# Altium project STM32F334R8T6Board_PRJ.PrjPcb
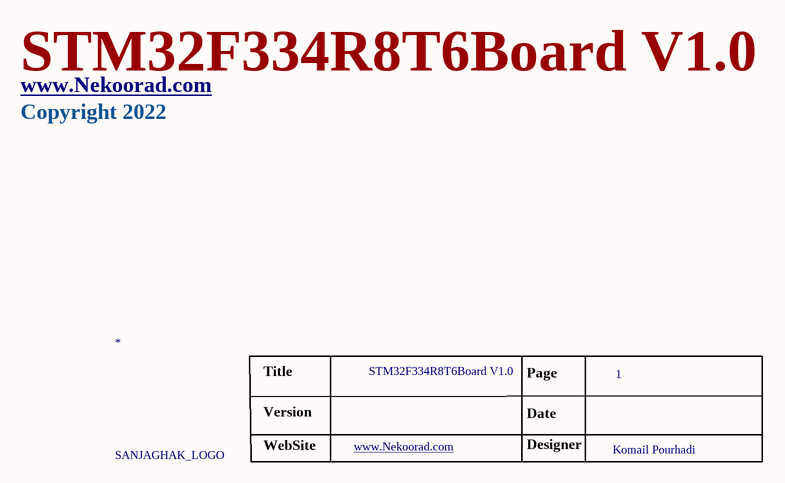
[diagram p0: [00]_NekooradGroup.SchDoc]
designer: Dotex:.; version: V1.0
4 sheets, 192 parts. Net scope: flat (ports and power ports of the same name join across sheets).
Board file: STM32F334R8T6Board_PCB.PcbDoc
Sheets:
  [00]_NekooradGroup.SchDoc
  [1]STM32F334R8T6Board_MCU.SchDoc
  [2]STM32F334R8T6Board_Interfaces.SchDoc
  [3]STM32F334R8T6Board_FilterAndOutputs.SchDoc

## Sheet [00]_NekooradGroup.SchDoc
size A

### Parts
*  SANJAGHAK_LOGO  [SANJAGHAK_LOGO]

### Notes on the sheet
- STM32F334R8T6Board V1.0
- www.Nekoorad.com <http://www.Nekoorad.com>
- Copyright 2022
- Title
- Page
- 1
- Version
- WebSite
- Date
- Designer
- Komail Pourhadi

## Sheet [1]STM32F334R8T6Board_MCU.SchDoc
size B
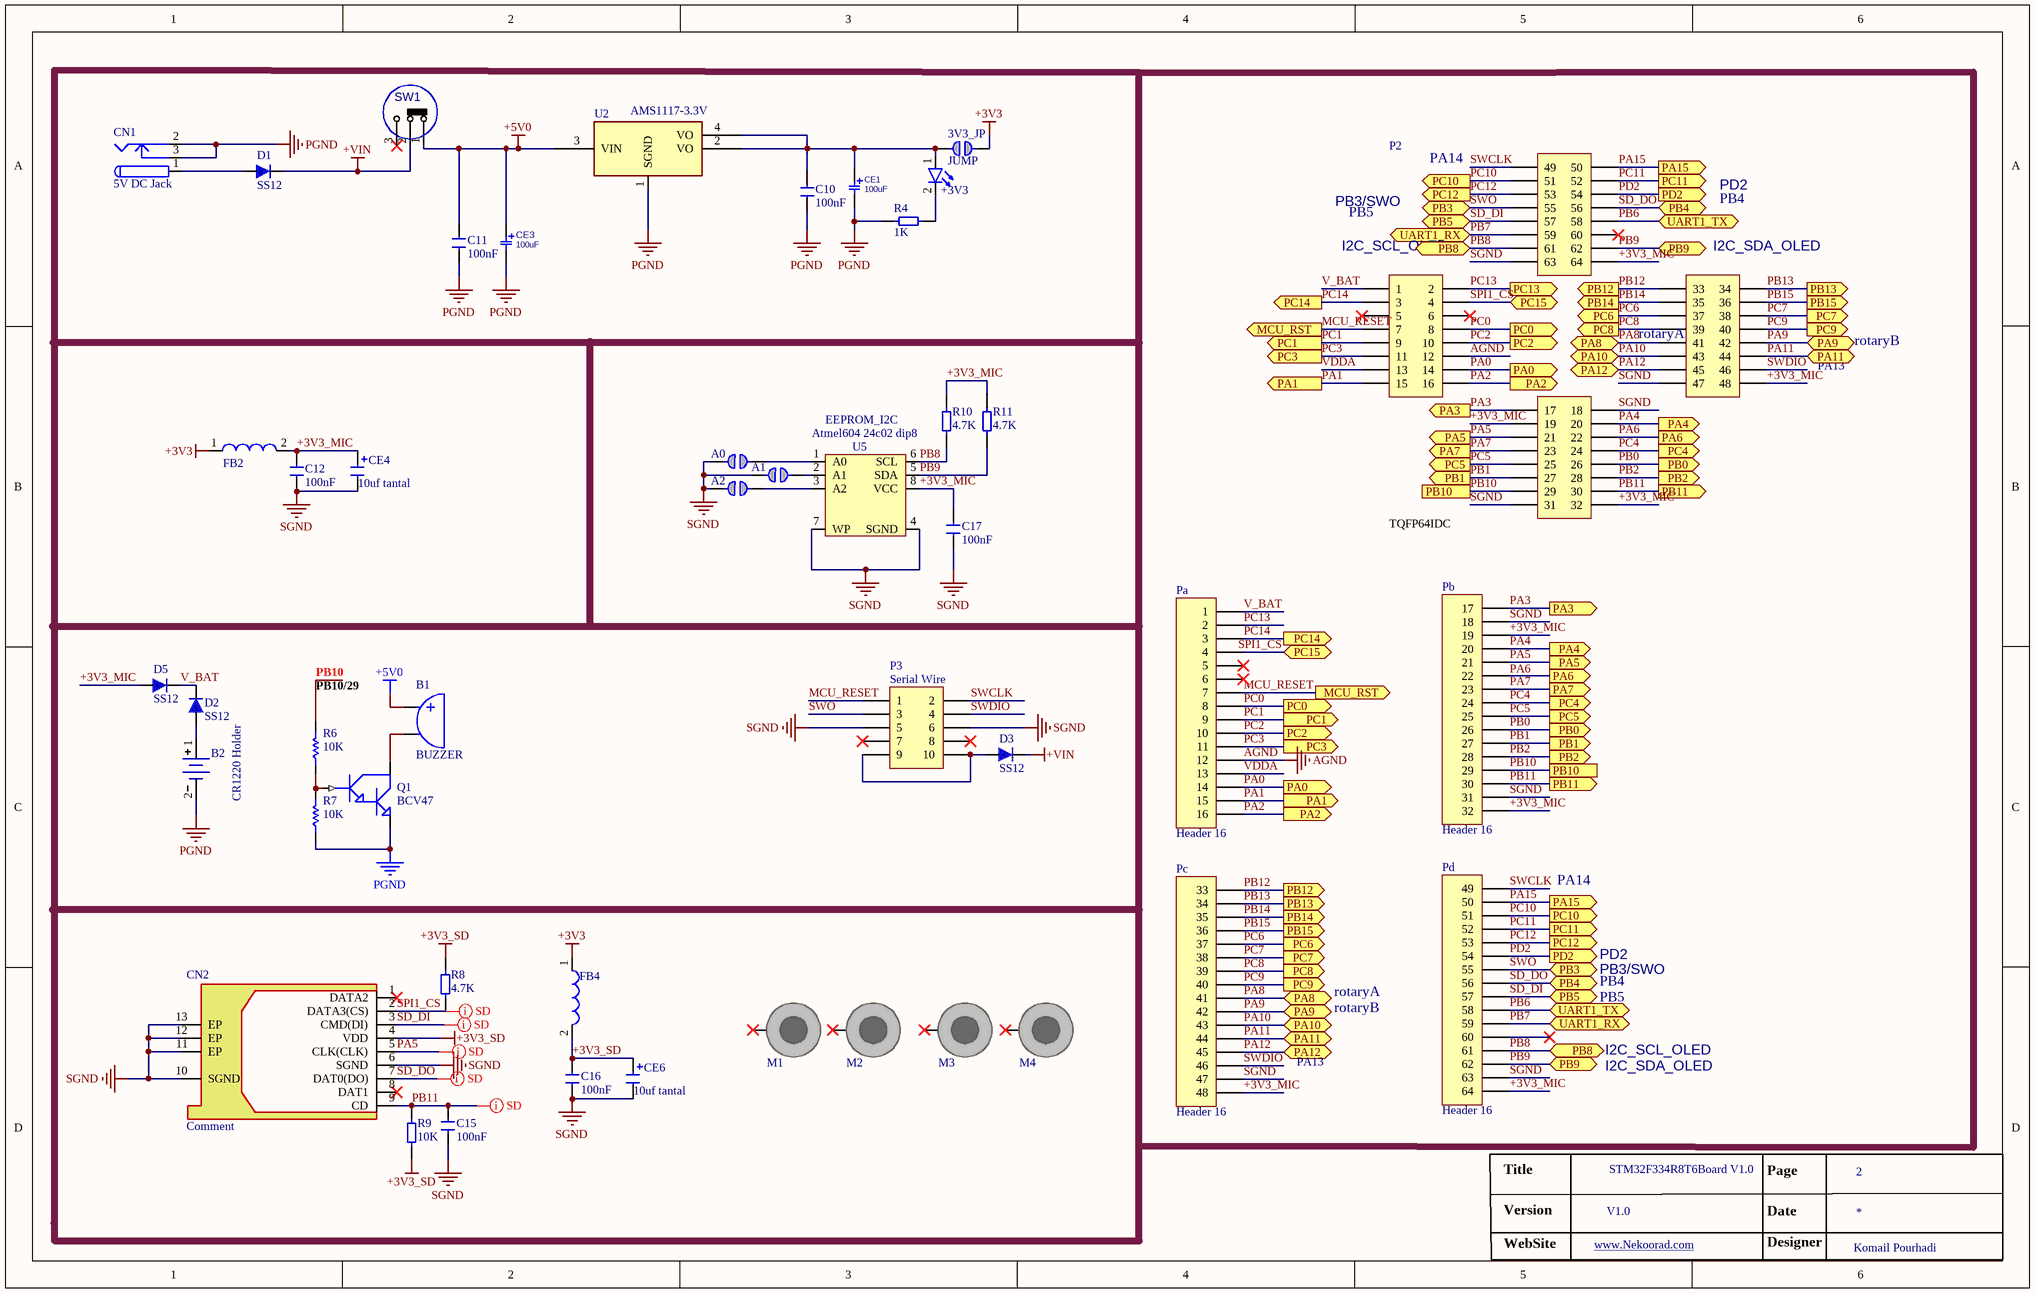
[diagram p1: [1]STM32F334R8T6Board_MCU.SchDoc]

### Parts
3V3_JP  JUMP  [RES_1206]
+3V3  HB  [LED SMD 1206]  (value not drawn)
A0  Comment  [HDR1X2]  (value not drawn)
A1  Comment  [HDR1X2]  (value not drawn)
A2  Comment  [HDR1X2]  (value not drawn)
B1  BUZZER  [BUZZ]
B2  CR1220 Holder  [Battery3]
C10  Comment  [SMD_CAP_1206]  (value not drawn)
C11  Comment  [SMD_CAP_1206]  (value not drawn)
C12  Comment  [SMD_CAP_1206]  (value not drawn)
C15  Comment  [SMD_CAP_1206]  (value not drawn)
C16  Comment  [SMD_CAP_1206]  (value not drawn)
C17  Comment  [SMD_CAP_1206]  (value not drawn)
CE1  value 100uF  [CAP-E-4]  (hidden comment: Comment)
CE3  value 100uF  [CAP-E-4]  (hidden comment: Comment)
CE4  10uf tantal  [cap-e-2]
CE6  10uf tantal  [cap-e-2]
CN1  5V DC Jack  [Power Jack]
CN2  Comment  [Micro sd csrd]
D1  SS12  [Diode SMA-M]
D2  SS12  [Diode SMA-M]
D3  SS12  [Diode SMA-M]
D5  SS12  [Diode SMA-M]
FB2  Comment  [r4p]  (value not drawn)
FB4  Comment  [r4p]  (value not drawn)
M1  Comment  [Stud-hole]  (value not drawn)  (no BOM)
M2  Comment  [Stud-hole]  (value not drawn)  (no BOM)
M3  Comment  [Stud-hole]  (value not drawn)  (no BOM)
M4  Comment  [Stud-hole]  (value not drawn)  (no BOM)
P2  TQFP64IDC  [tqfp64idc]
P3  Serial Wire  [IDC10-BOX]
Pa  Header 16  [HDR1X16]
Pb  Header 16  [HDR1X16]
Pc  Header 16  [HDR1X16]
Pd  Header 16  [HDR1X16]
Q1  BCV47  [SOT23_BEC_M]
R4  Comment  [RES_1206]  (value not drawn)
R6  10K  [RES_1206]
R7  10K  [RES_1206]
R8  Comment  [RES_1206]  (value not drawn)
R9  Comment  [RES_1206]  (value not drawn)
R10  Comment  [RES_1206]  (value not drawn)
R11  Comment  [RES_1206]  (value not drawn)
SW1  SlideSwitch  [HDR1X3]  (value not drawn)
U2  value AMS1117-3.3V  [MP04A_M]  (hidden comment: Comment)
U5  EEPROM_I2C  [dip8]

### Ports
MCU_RST (out), PA0 (out), PA1 (out), PA2 (out), PA3 (out), PA4 (out), PA5 (out), PA6 (out), PA7 (out), PA8 (bidir), PA9 (bidir), PA10 (bidir), PA11 (bidir), PA12 (bidir), PA15 (out), PB0 (out), PB1 (out), PB2 (out), PB3 (bidir), PB4 (bidir), PB5 (bidir), PB8 (bidir), PB9 (bidir), PB10, PB11 (out), PB12 (out), PB13 (out), PB14 (out), PB15 (out), PC0 (out), PC1 (out), PC2 (out), PC3 (out), PC4 (out), PC5 (out), PC6 (out), PC7 (out), PC8 (out), PC9 (out), PC10 (out), PC11 (out), PC12 (out), PC13 (out), PC14 (out), PC15 (bidir), PD2 (out), UART1_RX (bidir), UART1_TX (bidir)

### Nets
+3V3: 3V3_JP.2 FB2.1 FB4.1
+3V3_SD: C16.2 CE6.1 CN2.4(VDD) FB4.2 R8.1 R9.2
+5V0: B1.1 C11.2 CE3.1 SW1.1(P1) U2.3(VIN)
+VIN: D1.2(K) D3.2(K) SW1.2(P3)
AGND: P2.12 Pa.12
PB6: P2.58 Pd.58 ; port UART1_TX
PB7: P2.59 Pd.59 ; port UART1_RX
PGND: B2.2(-) C10.1 C11.1 CE1.2 CE3.2 CN1.2 CN1.3 Q1.2(E) R4.2 R7.1 U2.1(SGND)
SGND: A0.1 A1.1 A2.1 C12.1 C15.2 C16.1 C17.1 CE4.2 CE6.2 CN2.6(SGND) CN2.10(SGND) CN2.11(EP) CN2.12(EP) CN2.13(EP) P2.18 P2.31 P2.47 P2.63 P3.5 P3.6 Pb.18 Pb.31 Pc.47 Pd.63 U5.4(SGND) U5.7(WP)
+3V3_MIC: C12.2 C17.2 CE4.1 D5.1(A) FB2.2 P2.19 P2.32 P2.48 P2.64 Pb.19 Pb.32 Pc.48 Pd.64 R10.1 R11.1 U5.8(VCC)
MCU_RESET: P2.7 P3.1 Pa.7 ; port MCU_RST
PA0: P2.14 Pa.14 ; port PA0
PA1: P2.15 Pa.15 ; port PA1
PA2: P2.16 Pa.16 ; port PA2
PA3: P2.17 Pb.17 ; port PA3
PA4: P2.20 Pb.20 ; port PA4
PA5: CN2.5(CLK(CLK)) P2.21 Pb.21 ; port PA5
PA6: P2.22 Pb.22 ; port PA6
PA7: P2.23 Pb.23 ; port PA7
PA8: P2.41 Pc.41 ; port PA8  [project net KEY1A]
PA9: P2.42 Pc.42 ; port PA9  [project net KEY2B]
PA10: P2.43 Pc.43 ; port PA10  [project net KEY3]
PA11: P2.44 Pc.44 ; port PA11  [project net KEY4]
PA12: P2.45 Pc.45 ; port PA12  [project net KEY5]
PA15: P2.50 Pd.50 ; port PA15
PB0: P2.26 Pb.26 ; port PB0
PB1: P2.27 Pb.27 ; port PB1
PB2: P2.28 Pb.28 ; port PB2
PB8: P2.61 Pd.61 R10.2 U5.6(SCL) ; port PB8  [project net I2C_SCL_OLED]
PB9: P2.62 Pd.62 R11.2 U5.5(SDA) ; port PB9  [project net EN]
PB10: P2.29 Pb.29 R6.2 ; port PB10
PB11: C15.1 CN2.9(CD) P2.30 Pb.30 R9.1 ; port PB11
PB12: P2.33 Pc.33 ; port PB12
PB13: P2.34 Pc.34 ; port PB13
PB14: P2.35 Pc.35 ; port PB14
PB15: P2.36 Pc.36 ; port PB15
PC0: P2.8 Pa.8 ; port PC0
PC1: P2.9 Pa.9 ; port PC1
PC2: P2.10 Pa.10 ; port PC2
PC3: P2.11 Pa.11 ; port PC3
PC4: P2.24 Pb.24 ; port PC4
PC5: P2.25 Pb.25 ; port PC5
PC6: P2.37 Pc.37 ; port PC6
PC7: P2.38 Pc.38 ; port PC7
PC8: P2.39 Pc.39 ; port PC8
PC9: P2.40 Pc.40 ; port PC9
PC10: P2.51 Pd.51 ; port PC10
PC11: P2.52 Pd.52 ; port PC11
PC12: P2.53 Pd.53 ; port PC12
PC13: P2.2 Pa.2 ; port PC13  [project net BKL]
PC14: P2.3 Pa.3 ; port PC14  [project net KEY6]
PD2: P2.54 Pd.54 ; port PD2
SD_DI: CN2.3(CMD(DI)) P2.57 Pd.57 ; port PB5
SD_DO: CN2.7(DAT0(DO)) P2.56 Pd.56 ; port PB4
SPI1_CS: CN2.2(DATA3(CS)) P2.4 Pa.4 R8.2 ; port PC15
SWCLK: P2.49 P3.2 Pd.49
SWDIO: P2.46 P3.4 Pc.46
SWO: P2.55 P3.3 Pd.55 ; port PB3
V_BAT: D2.2(K) D5.2(K) P2.1 Pa.1
VDDA: P2.13 Pa.13
Net3V3_JP_1: 3V3_JP.1 +3V3.1(A) C10.2 CE1.1 U2.2(VO) U2.4(VO)
Net+3V3_2: +3V3.2(K) R4.1
NetA0_2: A0.2 U5.1(A0)
NetA1_2: A1.2 U5.2(A1)
NetA2_2: A2.2 U5.3(A2)
NetB1_2: B1.2 Q1.3(C)
NetB2_1: B2.1(+) D2.1(A)
NetCN1_1: CN1.1 D1.1(A)
NetD3_1: D3.1(A) P3.9 P3.10
NetQ1_1: Q1.1(B) R6.1 R7.2

Not connected (* = marked no-connect by the designer): CN2 1(DATA2)* 8(DAT1)*; M1 1*; M2 1*; M3 1*; M4 1*; P2 5* 6* 60*; P3 7* 8*; Pa 5* 6*; Pd 60*; SW1 3(P4)*

### Layout directives
net class SD_card: PA5, PB11, SD_DI, SD_DO, SPI1_CS

### Notes on the sheet
- (near P2) PA14
- (near P2) PB3/SWO
- (near P2) PB5
- (near P2) PD2
- (near P2) PB4
- (near P2) I2C_SCL_OLED
- (near P2) I2C_SDA_OLED
- (near P2) rotaryA
- PA13
- rotaryB
- Atmel604 24c02 dip8
- PB10/29
- PA14
- PB3/SWO
- PD2
- rotaryA
- PB5
- PB4
- I2C_SCL_OLED
- I2C_SDA_OLED
- Title
- STM32F334R8T6Board V1.0
- Page
- 2
- Version
- WebSite
- www.Nekoorad.com <http://www.Nekoorad.com>
- Date
- Designer
- Komail Pourhadi
- Labels drawn without touching a wire or pin: PA6, SPI1_CS
- (in symbol Capacitor SMD) 100nF
- (in symbol Resistor SMD) 1K; 4.7K; 10K

### Library data of the parts
3V3_JP A0-A2 = jumper SMD
+3V3 = LED: Designer: Saeid Jorablo; Organazation: ControTec; Adding Date: 1387/12/22; Color: HB; Size: SMD 1206
B2 = Battry Backup
C10-C12 C15-C17 = Capacitor SMD
CE1 CE3 = CAP_THD_EL_10u25V: CAP, THD, ELEC, 10uF, 25V; MANF_P#: MANF_PART#; PARAM: 25V; MANF: MANF; PARAM2: PARAM2
CE4 CE6 = Capacitor Tantalium
CN1 = Power Jack
CN2 = Micro SD Card
D1-D3 D5 = 1N4001
FB2 FB4 = Ferrit Bead
M1-M4 = SCMH_M1P6: SCREW mouting, M1.6, 1.6mm diameter and 3.2mm PanHead; VALUE: DNP/MH; ASSEMBLY: DNP
P3 = Header 5X2: Header, 5-Pin, Dual row; LatestRevisionDate: 17-Jul-2002; LatestRevisionNote: Re-released for DXP Platform.; Publisher: Altium Limited
Pa Pb Pc Pd = Header 16: Header, 16-Pin; LatestRevisionDate: 17-Jul-2002; LatestRevisionNote: Re-released for DXP Platform.; Publisher: Altium Limited
Q1 = NPN DAR
R4 R8-R11 = Resistor SMD
R6 R7 = Resistor: Tolerance: 5%; Power: 1/8 W; Value: 10K
SW1 = SWSLIDT_SPDT_S_8X4: SWITCH, SLIDE, SPDT, 8.6X4.3mm, THD; MANF_PART#: OS102011MS2QN1; MANF: C&K; DESC: DESCRIPTION; VALUE: SlideSwitch; ASSEMBLY: ASSEMBLY; PARAM: PARAM; PRICE: 0.4$
U2 = VREG_1117_SOT223: REG, Linear, LDO1V, 0.8A, SOT-223; MANF_P#: LD1117, LM1117, AMS1117, TLV1117, REG1117, NCP1117, LT1117, SPX1117; MANF: TI, ON, ST; PARAM2: 1.2/1.5/1.8/2.5/2.85/3.3/5V; PARAM: LDO1V, 0.8A
U5 = AT24C128

## Sheet [2]STM32F334R8T6Board_Interfaces.SchDoc
size B
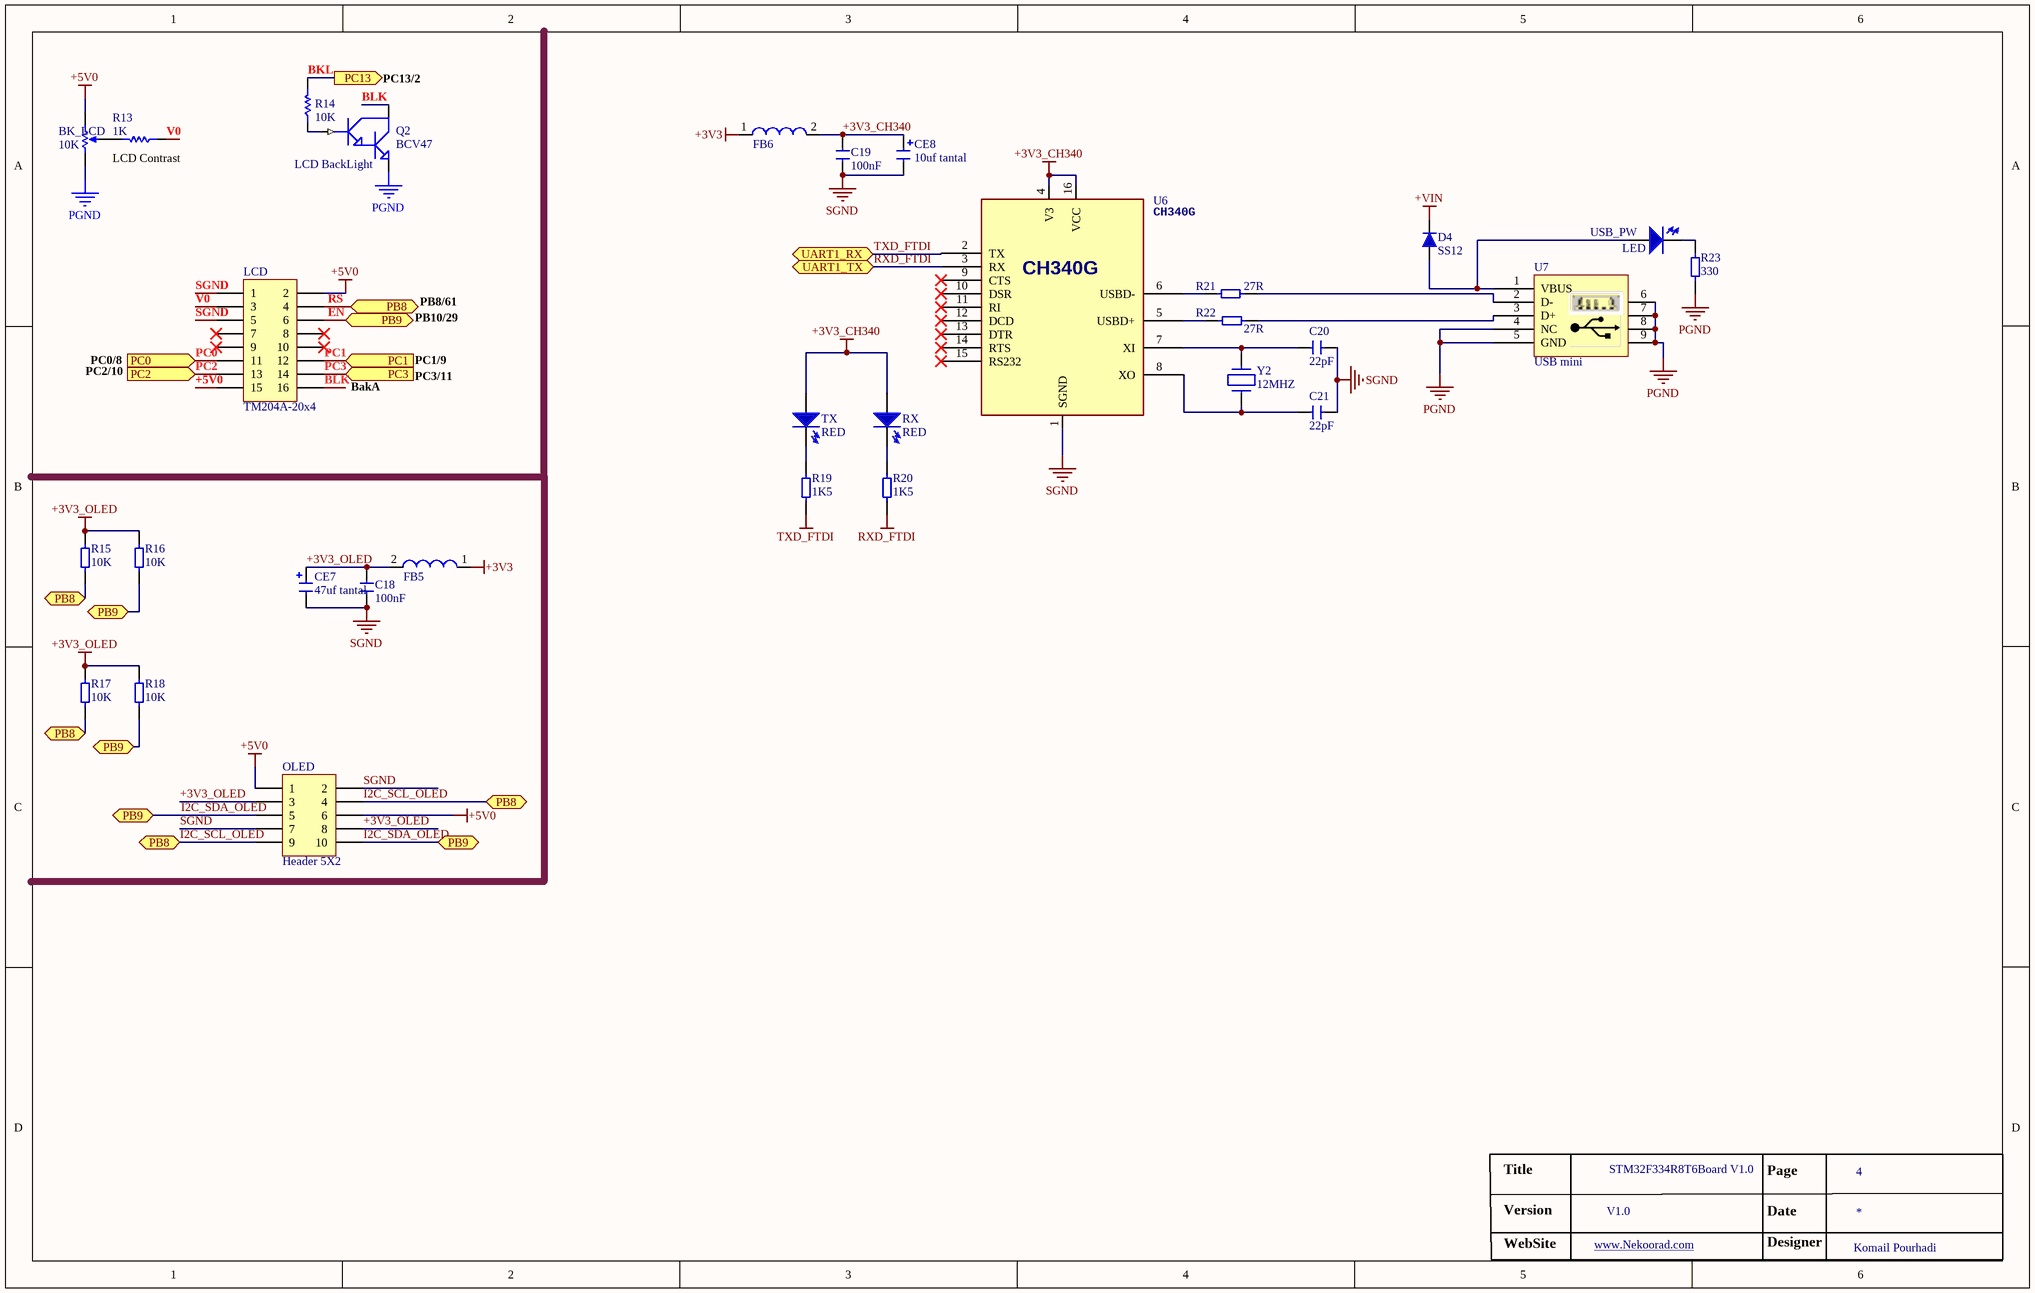
[diagram p2: [2]STM32F334R8T6Board_Interfaces.SchDoc]

### Parts
BK_LCD  value 10K  [JFP]  (hidden comment: RPot)
C18  Comment  [SMD_CAP_1206]  (value not drawn)
C19  Comment  [SMD_CAP_1206]  (value not drawn)
C20  Comment  [SMD_CAP_1206]  (value not drawn)
C21  Comment  [SMD_CAP_1206]  (value not drawn)
CE7  47uf tantal  [CAP-E-3]
CE8  10uf tantal  [cap-e-2]
D4  SS12  [Diode SMA-M]
FB5  Comment  [r4p]  (value not drawn)
FB6  Comment  [r4p]  (value not drawn)
LCD  TM204A-20x4  [IDC16_BOX]
OLED  Header 5X2  [IDC10-BOX]
Q2  BCV47  [SOT23_BEC_M]
R13  1K  [RES_1206]
R14  10K  [RES_1206]
R15  RESISTOR  [RES_1206]  (value not drawn)
R16  RESISTOR  [RES_1206]  (value not drawn)
R17  RESISTOR  [RES_1206]  (value not drawn)
R18  RESISTOR  [RES_1206]  (value not drawn)
R19  RESISTOR  [RES_1206]  (value not drawn)
R20  RESISTOR  [RES_1206]  (value not drawn)
R21  Comment  [RES_1206]  (value not drawn)
R22  Comment  [RES_1206]  (value not drawn)
R23  Comment  [RES_1206]  (value not drawn)
RX  RED  [LED SMD 1206]
TX  RED  [LED SMD 1206]
U6  CH340G  [Header smd 2*8]
U7  USB mini  [SMD_Mini USB Connector]
USB_PW  LED  [LED SMD 1206]
Y2  12MHZ  [Crystal SMD]

### Ports
PB8 (bidir), PB9 (bidir), PC0 (in), PC1 (in), PC2 (in), PC3 (in), PC13 (out), UART1_RX (bidir), UART1_TX (bidir)

### Nets
+3V3: FB5.1 FB6.1
+3V3_CH340: C19.2 CE8.1 FB6.2 RX.1(A) TX.1(A) U6.4(V3) U6.16(VCC)
+3V3_OLED: C18.2 CE7.1 FB5.2 OLED.3 OLED.8 R15.1 R16.1 R17.1 R18.1
+5V0: BK_LCD.3(BOT) LCD.2 LCD.15 OLED.1 OLED.6
+VIN: D4.2(K)
PGND: BK_LCD.1(TOP) Q2.2(E) R23.2 U7.4(NC) U7.5(GND) U7.6 U7.7 U7.8 U7.9
RXD_FTDI: R20.1 U6.3(RX) ; port UART1_TX  [project net PB6]
SGND: C18.1 C19.1 C20.1 C21.2 CE7.2 CE8.2 LCD.1 LCD.5 OLED.2 OLED.7 U6.1(SGND)
TXD_FTDI: R19.1 U6.2(TX) ; port UART1_RX  [project net PB7]
BKL: R14.2 ; port PC13
BLK: LCD.16 Q2.3(C)
EN: LCD.6 OLED.5 OLED.10 R16.2 R18.2 ; port PB9  [also labelled I2C_SDA_OLED]
I2C_SCL_OLED: LCD.4 OLED.4 OLED.9 R15.2 R17.2 ; port PB8  [also labelled RS]
PC0: LCD.11 ; port PC0
PC1: LCD.12 ; port PC1
PC2: LCD.13 ; port PC2
PC3: LCD.14 ; port PC3
V0: LCD.3 R13.1
NetBK_LCD_2: BK_LCD.2(TAP) R13.2
NetC20_2: C20.2 U6.7(XI) Y2.2
NetC21_1: C21.1 U6.8(XO) Y2.1
NetD4_1: D4.1(A) U7.1(VBUS) USB_PW.1(A)
NetQ2_1: Q2.1(B) R14.1
NetR19_2: R19.2 TX.2(K)
NetR20_2: R20.2 RX.2(K)
NetR21_1: R21.1 U6.6(USBD-)
NetR21_2: R21.2 U7.2(D-)
NetR22_1: R22.1 U6.5(USBD+)
NetR22_2: R22.2 U7.3(D+)
NetR23_1: R23.1 USB_PW.2(K)

Not connected (* = marked no-connect by the designer): LCD 7* 8* 9* 10*; U6 9(CTS)* 10(DSR)* 11(RI)* 12(DCD)* 13(DTR)* 14(RTS)* 15(RS232)*

### Notes on the sheet
- (near Q2) PC13/2
- LCD Contrast
- (near Q2) LCD BackLight
- PC0/8
- PC1/9
- PB10/29
- PB8/61
- PC2/10
- (near LCD) BakA
- PC3/11
- Title
- STM32F334R8T6Board V1.0
- Page
- 4
- Version
- WebSite
- www.Nekoorad.com <http://www.Nekoorad.com>
- Date
- Designer
- Komail Pourhadi
- (in symbol Capacitor SMD) 22pF; 100nF
- (in symbol Resistor SMD) 1K5; 27R; 10K; 330

### Library data of the parts
BK_LCD = RPot: Potentiometer; Sim Note: Enter the Resistance value and the set point into parameter fields.; Set Position: 0.5; Published: 8-Jun-2000; LatestRevisionDate: 17-Jul-2002; LatestRevisionNote: Re-released for DXP Platform.; PackageReference: VR5; Publisher: Altium Limited; PackageDescription: Variable Resistor, Thru-Hole; 3 Leads
C18-C21 = Capacitor SMD
CE7 CE8 = Capacitor Tantalium
D4 = 1N4001
FB5 FB6 = Ferrit Bead
LCD = Header 8X2: Header, 8-Pin, Dual row; LatestRevisionDate: 17-Jul-2002; LatestRevisionNote: Re-released for DXP Platform.; Publisher: Altium Limited
OLED = Header 5X2: Header, 5-Pin, Dual row; LatestRevisionDate: 17-Jul-2002; LatestRevisionNote: Re-released for DXP Platform.; Publisher: Altium Limited
Q2 = NPN DAR
R13 R14 = Resistor: Tolerance: 5%; Power: 1/8 W
  R13: Value: 1K
  R14: Value: 10K
R15-R23 = Resistor SMD
RX TX USB_PW = LED SMD
U6 = CH340G_SOP16: USB-UART; MANF_P#: CH340G; VALUE: CH340G
U7 = USB mini: mini USB Connector
Y2 = Xtal

## Sheet [3]STM32F334R8T6Board_FilterAndOutputs.SchDoc
size B
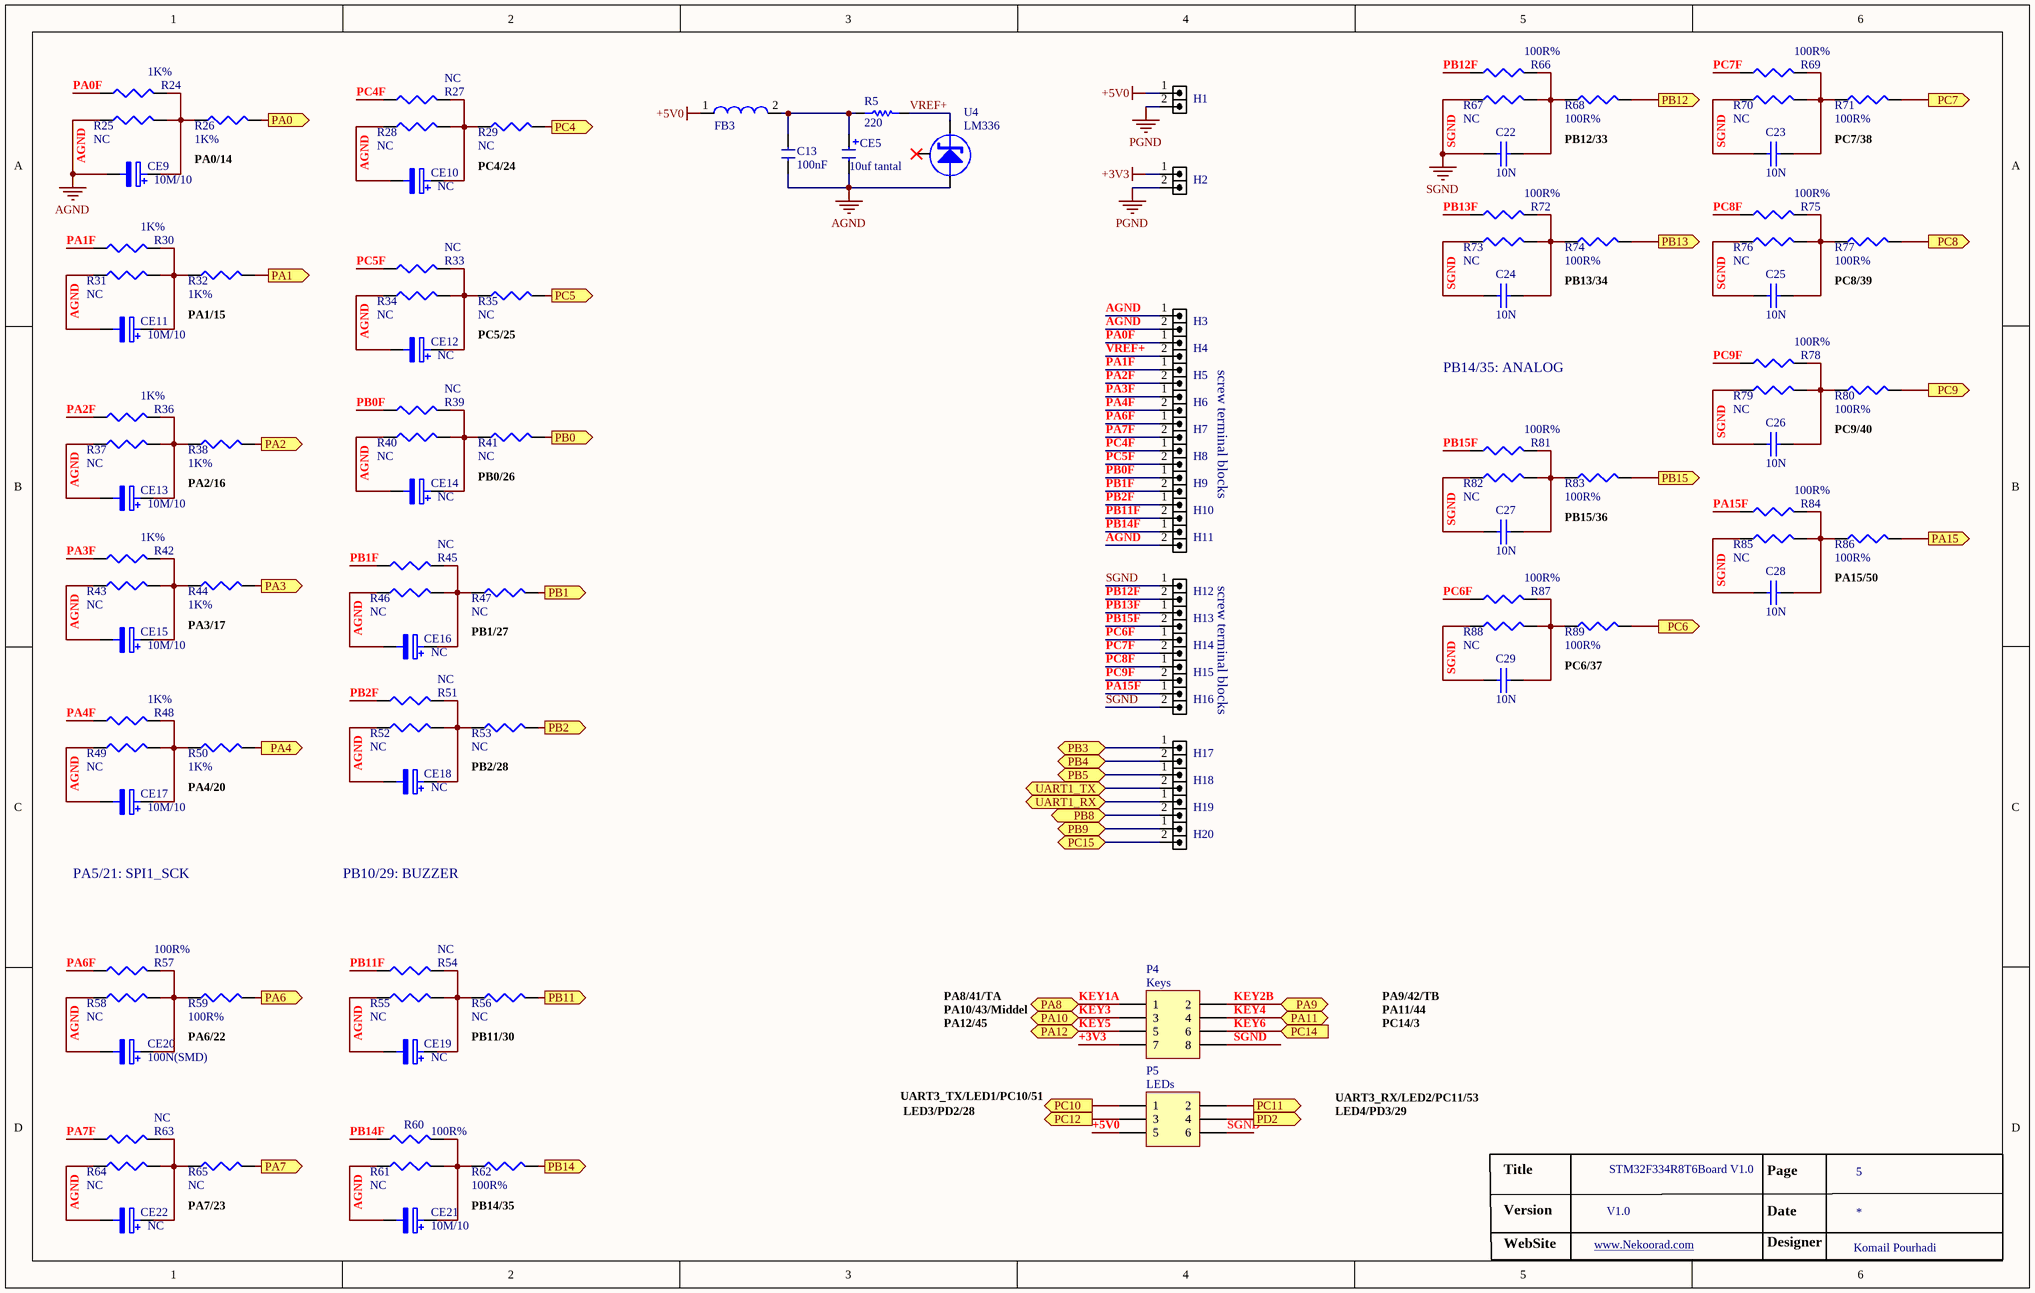
[diagram p3: [3]STM32F334R8T6Board_FilterAndOutputs.SchDoc]

### Parts
C13  Comment  [SMD_CAP_1206]  (value not drawn)
C22  10N  [SMD_CAP_1206]
C23  10N  [SMD_CAP_1206]
C24  10N  [SMD_CAP_1206]
C25  10N  [SMD_CAP_1206]
C26  10N  [SMD_CAP_1206]
C27  10N  [SMD_CAP_1206]
C28  10N  [SMD_CAP_1206]
C29  10N  [SMD_CAP_1206]
CE5  10uf tantal  [cap-e-2]
CE9  10M/10  [CAP E+1206]
CE10  NC  [CAP E+1206]
CE11  10M/10  [CAP E+1206]
CE12  NC  [CAP E+1206]
CE13  10M/10  [CAP E+1206]
CE14  NC  [CAP E+1206]
CE15  10M/10  [CAP E+1206]
CE16  NC  [CAP E+1206]
CE17  10M/10  [CAP E+1206]
CE18  NC  [CAP E+1206]
CE19  NC  [CAP E+1206]
CE20  100N(SMD)  [CAP E+1206]
CE21  10M/10  [CAP E+1206]
CE22  NC  [CAP E+1206]
FB3  Comment  [r4p]  (value not drawn)
H1  HDRM2  [header screw 2*1]  (value not drawn)
H2  HDRM2  [header screw 2*1]  (value not drawn)
H3  HDRM2  [header screw 2*1]  (value not drawn)
H4  HDRM2  [header screw 2*1]  (value not drawn)
H5  HDRM2  [header screw 2*1]  (value not drawn)
H6  HDRM2  [header screw 2*1]  (value not drawn)
H7  HDRM2  [header screw 2*1]  (value not drawn)
H8  HDRM2  [header screw 2*1]  (value not drawn)
H9  HDRM2  [header screw 2*1]  (value not drawn)
H10  HDRM2  [header screw 2*1]  (value not drawn)
H11  HDRM2  [header screw 2*1]  (value not drawn)
H12  HDRM2  [header screw 2*1]  (value not drawn)
H13  HDRM2  [header screw 2*1]  (value not drawn)
H14  HDRM2  [header screw 2*1]  (value not drawn)
H15  HDRM2  [header screw 2*1]  (value not drawn)
H16  HDRM2  [header screw 2*1]  (value not drawn)
H17  HDRM2  [header screw 2*1]  (value not drawn)
H18  HDRM2  [header screw 2*1]  (value not drawn)
H19  HDRM2  [header screw 2*1]  (value not drawn)
H20  HDRM2  [header screw 2*1]  (value not drawn)
P4  Keys  [IDC8-BOX]
P5  LEDs  [IDC6-BOX]
R5  220  [RES_1206]
R24  1K%  [RES_1206]
R25  NC  [RES_1206]
R26  1K%  [RES_1206]
R27  NC  [RES_1206]
R28  NC  [RES_1206]
R29  NC  [RES_1206]
R30  1K%  [RES_1206]
R31  NC  [RES_1206]
R32  1K%  [RES_1206]
R33  NC  [RES_1206]
R34  NC  [RES_1206]
R35  NC  [RES_1206]
R36  1K%  [RES_1206]
R37  NC  [RES_1206]
R38  1K%  [RES_1206]
R39  NC  [RES_1206]
R40  NC  [RES_1206]
R41  NC  [RES_1206]
R42  1K%  [RES_1206]
R43  NC  [RES_1206]
R44  1K%  [RES_1206]
R45  NC  [RES_1206]
R46  NC  [RES_1206]
R47  NC  [RES_1206]
R48  1K%  [RES_1206]
R49  NC  [RES_1206]
R50  1K%  [RES_1206]
R51  NC  [RES_1206]
R52  NC  [RES_1206]
R53  NC  [RES_1206]
R54  NC  [RES_1206]
R55  NC  [RES_1206]
R56  NC  [RES_1206]
R57  100R%  [RES_1206]
R58  NC  [RES_1206]
R59  100R%  [RES_1206]
R60  100R%  [RES_1206]
R61  NC  [RES_1206]
R62  100R%  [RES_1206]
R63  NC  [RES_1206]
R64  NC  [RES_1206]
R65  NC  [RES_1206]
R66  100R%  [RES_1206]
R67  NC  [RES_1206]
R68  100R%  [RES_1206]
R69  100R%  [RES_1206]
R70  NC  [RES_1206]
R71  100R%  [RES_1206]
R72  100R%  [RES_1206]
R73  NC  [RES_1206]
R74  100R%  [RES_1206]
R75  100R%  [RES_1206]
R76  NC  [RES_1206]
R77  100R%  [RES_1206]
R78  100R%  [RES_1206]
R79  NC  [RES_1206]
R80  100R%  [RES_1206]
R81  100R%  [RES_1206]
R82  NC  [RES_1206]
R83  100R%  [RES_1206]
R84  100R%  [RES_1206]
R85  NC  [RES_1206]
R86  100R%  [RES_1206]
R87  100R%  [RES_1206]
R88  NC  [RES_1206]
R89  100R%  [RES_1206]
U4  LM336  [LM336]

### Ports
PA0 (out), PA1 (out), PA2 (out), PA3 (out), PA4 (out), PA6 (out), PA7 (out), PA8 (bidir), PA9 (bidir), PA10 (bidir), PA11 (bidir), PA12 (bidir), PA15 (out), PB0 (out), PB1 (out), PB2 (out), PB3 (bidir), PB4 (bidir), PB5 (bidir), PB8 (bidir), PB9 (bidir), PB11 (out), PB12 (out), PB13 (out), PB14 (out), PB15 (out), PC4 (out), PC5 (out), PC6 (out), PC7 (out), PC8 (out), PC9 (out), PC10 (out), PC11 (out), PC12 (out), PC14 (in), PC15 (bidir), PD2 (out), UART1_RX (bidir), UART1_TX (bidir)

### Nets
+3V3: H2.1 P4.7
+5V0: FB3.1 H1.1 P5.5
AGND: C13.1 CE5.2 CE9.2 CE10.2 CE11.2 CE12.2 CE13.2 CE14.2 CE15.2 CE16.2 CE17.2 CE18.2 CE19.2 CE20.2 CE21.2 CE22.2 H3.1 H3.2 H11.2 R25.1 R28.1 R31.1 R34.1 R37.1 R40.1 R43.1 R46.1 R49.1 R52.1 R55.1 R58.1 R61.1 R64.1 U4.1
PB6: H18.2 ; port UART1_TX
PB7: H19.1 ; port UART1_RX
PGND: H1.2 H2.2
SGND: C22.2 C23.2 C24.2 C25.2 C26.2 C27.2 C28.2 C29.2 H12.1 H16.2 P4.8 P5.6 R67.1 R70.1 R73.1 R76.1 R79.1 R82.1 R85.1 R88.1
EN: H20.1 ; port PB9
I2C_SCL_OLED: H19.2 ; port PB8
KEY1A: P4.1 ; port PA8
KEY2B: P4.2 ; port PA9
KEY3: P4.3 ; port PA10
KEY4: P4.4 ; port PA11
KEY5: P4.5 ; port PA12
KEY6: P4.6 ; port PC14
PA0: R26.2 ; port PA0
PA0F: H4.1 R24.1
PA1: R32.2 ; port PA1
PA1F: H5.1 R30.1
PA2: R38.2 ; port PA2
PA2F: H5.2 R36.1
PA3: R44.2 ; port PA3
PA3F: H6.1 R42.1
PA4: R50.2 ; port PA4
PA4F: H6.2 R48.1
PA6: R59.2 ; port PA6
PA6F: H7.1 R57.1
PA7: R65.2 ; port PA7
PA7F: H7.2 R63.1
PA15: R86.2 ; port PA15
PA15F: H16.1 R84.1
PB0: R41.2 ; port PB0
PB0F: H9.1 R39.1
PB1: R47.2 ; port PB1
PB1F: H9.2 R45.1
PB2: R53.2 ; port PB2
PB2F: H10.1 R51.1
PB11: R56.2 ; port PB11
PB11F: H10.2 R54.1
PB12: R68.2 ; port PB12
PB12F: H12.2 R66.1
PB13: R74.2 ; port PB13
PB13F: H13.1 R72.1
PB14: R62.2 ; port PB14
PB14F: H11.1 R60.1
PB15: R83.2 ; port PB15
PB15F: H13.2 R81.1
PC4: R29.2 ; port PC4
PC4F: H8.1 R27.1
PC5: R35.2 ; port PC5
PC5F: H8.2 R33.1
PC6: R89.2 ; port PC6
PC6F: H14.1 R87.1
PC7: R71.2 ; port PC7
PC7F: H14.2 R69.1
PC8: R77.2 ; port PC8
PC8F: H15.1 R75.1
PC9: R80.2 ; port PC9
PC9F: H15.2 R78.1
PC10: P5.1 ; port PC10
PC11: P5.2 ; port PC11
PC12: P5.3 ; port PC12
PD2: P5.4 ; port PD2
SD_DI: H18.1 ; port PB5
SD_DO: H17.2 ; port PB4
SPI1_CS: H20.2 ; port PC15
SWO: H17.1 ; port PB3
VREF+: H4.2 R5.2 U4.2
NetC13_2: C13.2 CE5.1 FB3.2 R5.1
NetC22_1: C22.1 R66.2 R67.2 R68.1
NetC23_1: C23.1 R69.2 R70.2 R71.1
NetC24_1: C24.1 R72.2 R73.2 R74.1
NetC25_1: C25.1 R75.2 R76.2 R77.1
NetC26_1: C26.1 R78.2 R79.2 R80.1
NetC27_1: C27.1 R81.2 R82.2 R83.1
NetC28_1: C28.1 R84.2 R85.2 R86.1
NetC29_1: C29.1 R87.2 R88.2 R89.1
NetCE9_1: CE9.1 R24.2 R25.2 R26.1
NetCE10_1: CE10.1 R27.2 R28.2 R29.1
NetCE11_1: CE11.1 R30.2 R31.2 R32.1
NetCE12_1: CE12.1 R33.2 R34.2 R35.1
NetCE13_1: CE13.1 R36.2 R37.2 R38.1
NetCE14_1: CE14.1 R39.2 R40.2 R41.1
NetCE15_1: CE15.1 R42.2 R43.2 R44.1
NetCE16_1: CE16.1 R45.2 R46.2 R47.1
NetCE17_1: CE17.1 R48.2 R49.2 R50.1
NetCE18_1: CE18.1 R51.2 R52.2 R53.1
NetCE19_1: CE19.1 R54.2 R55.2 R56.1
NetCE20_1: CE20.1 R57.2 R58.2 R59.1
NetCE21_1: CE21.1 R60.2 R61.2 R62.1
NetCE22_1: CE22.1 R63.2 R64.2 R65.1

Not connected (* = marked no-connect by the designer): U4 3*

### Notes on the sheet
- PA0/14
- PB12/33
- PC7/38
- PC4/24
- PB13/34
- PC8/39
- PA1/15
- PC5/25
- screw terminal blocks
- PB14/35: ANALOG
- PC9/40
- PA2/16
- PB0/26
- PB15/36
- PA3/17
- PB1/27
- PA15/50
- PC6/37
- PB2/28
- PA4/20
- PA5/21: SPI1_SCK
- PB10/29: BUZZER
- PA6/22
- PB11/30
- PA8/41/TA
- PA10/43/Middel
- PA12/45
- PA9/42/TB
- PA11/44
- PC14/3
- UART3_TX/LED1/PC10/51
- UART3_RX/LED2/PC11/53
- LED3/PD2/28
- LED4/PD3/29
- Title
- STM32F334R8T6Board V1.0
- Page
- 5
- PA7/23
- PB14/35
- Version
- WebSite
- www.Nekoorad.com <http://www.Nekoorad.com>
- Date
- Designer
- Komail Pourhadi
- (in symbol Capacitor SMD) 100nF

### Library data of the parts
C13 = Capacitor SMD
C22-C29 = C
CE5 = Capacitor Tantalium
CE9-CE22 = E
FB3 = Ferrit Bead
H1-H20 = HDR_M_1X2: CONN, HEADER, Male, pitch: 2.54mm, 2POS; VALUE: HDRM2
P4 = Header 4X2: Header, 4-Pin, Dual row; LatestRevisionDate: 17-Jul-2002; LatestRevisionNote: Re-released for DXP Platform.; Publisher: Altium Limited
P5 = Header 3X2: Header, 3-Pin, Dual row; LatestRevisionDate: 17-Jul-2002; LatestRevisionNote: Re-released for DXP Platform.; Publisher: Altium Limited
R5 = Resistor: Tolerance: 5%; Power: 1/8 W; Value: 220
R24-R89 = R

## Nets that join several sheets
+3V3: [1]STM32F334R8T6Board_MCU (3V3_JP.2 FB2.1 FB4.1), [2]STM32F334R8T6Board_Interfaces (FB5.1 FB6.1), [3]STM32F334R8T6Board_FilterAndOutputs (H2.1 P4.7)
+5V0: [1]STM32F334R8T6Board_MCU (5 pins), [2]STM32F334R8T6Board_Interfaces (5 pins), [3]STM32F334R8T6Board_FilterAndOutputs (FB3.1 H1.1 P5.5)
+VIN: [1]STM32F334R8T6Board_MCU (D1.2 D3.2 SW1.2), [2]STM32F334R8T6Board_Interfaces (D4.2)
AGND: [1]STM32F334R8T6Board_MCU (P2.12 Pa.12), [3]STM32F334R8T6Board_FilterAndOutputs (34 pins)
PB6: [1]STM32F334R8T6Board_MCU (P2.58 Pd.58), [2]STM32F334R8T6Board_Interfaces (R20.1 U6.3), [3]STM32F334R8T6Board_FilterAndOutputs (H18.2)
PB7: [1]STM32F334R8T6Board_MCU (P2.59 Pd.59), [2]STM32F334R8T6Board_Interfaces (R19.1 U6.2), [3]STM32F334R8T6Board_FilterAndOutputs (H19.1)
PGND: [1]STM32F334R8T6Board_MCU (11 pins), [2]STM32F334R8T6Board_Interfaces (9 pins), [3]STM32F334R8T6Board_FilterAndOutputs (H1.2 H2.2)
SGND: [1]STM32F334R8T6Board_MCU (26 pins), [2]STM32F334R8T6Board_Interfaces (11 pins), [3]STM32F334R8T6Board_FilterAndOutputs (20 pins)
BKL: [1]STM32F334R8T6Board_MCU (P2.2 Pa.2), [2]STM32F334R8T6Board_Interfaces (R14.2)
EN: [1]STM32F334R8T6Board_MCU (P2.62 Pd.62 R11.2 U5.5), [2]STM32F334R8T6Board_Interfaces (5 pins), [3]STM32F334R8T6Board_FilterAndOutputs (H20.1)
I2C_SCL_OLED: [1]STM32F334R8T6Board_MCU (P2.61 Pd.61 R10.2 U5.6), [2]STM32F334R8T6Board_Interfaces (5 pins), [3]STM32F334R8T6Board_FilterAndOutputs (H19.2)
KEY1A: [1]STM32F334R8T6Board_MCU (P2.41 Pc.41), [3]STM32F334R8T6Board_FilterAndOutputs (P4.1)
KEY2B: [1]STM32F334R8T6Board_MCU (P2.42 Pc.42), [3]STM32F334R8T6Board_FilterAndOutputs (P4.2)
KEY3: [1]STM32F334R8T6Board_MCU (P2.43 Pc.43), [3]STM32F334R8T6Board_FilterAndOutputs (P4.3)
KEY4: [1]STM32F334R8T6Board_MCU (P2.44 Pc.44), [3]STM32F334R8T6Board_FilterAndOutputs (P4.4)
KEY5: [1]STM32F334R8T6Board_MCU (P2.45 Pc.45), [3]STM32F334R8T6Board_FilterAndOutputs (P4.5)
KEY6: [1]STM32F334R8T6Board_MCU (P2.3 Pa.3), [3]STM32F334R8T6Board_FilterAndOutputs (P4.6)
PA0: [1]STM32F334R8T6Board_MCU (P2.14 Pa.14), [3]STM32F334R8T6Board_FilterAndOutputs (R26.2)
PA1: [1]STM32F334R8T6Board_MCU (P2.15 Pa.15), [3]STM32F334R8T6Board_FilterAndOutputs (R32.2)
PA2: [1]STM32F334R8T6Board_MCU (P2.16 Pa.16), [3]STM32F334R8T6Board_FilterAndOutputs (R38.2)
PA3: [1]STM32F334R8T6Board_MCU (P2.17 Pb.17), [3]STM32F334R8T6Board_FilterAndOutputs (R44.2)
PA4: [1]STM32F334R8T6Board_MCU (P2.20 Pb.20), [3]STM32F334R8T6Board_FilterAndOutputs (R50.2)
PA6: [1]STM32F334R8T6Board_MCU (P2.22 Pb.22), [3]STM32F334R8T6Board_FilterAndOutputs (R59.2)
PA7: [1]STM32F334R8T6Board_MCU (P2.23 Pb.23), [3]STM32F334R8T6Board_FilterAndOutputs (R65.2)
PA15: [1]STM32F334R8T6Board_MCU (P2.50 Pd.50), [3]STM32F334R8T6Board_FilterAndOutputs (R86.2)
PB0: [1]STM32F334R8T6Board_MCU (P2.26 Pb.26), [3]STM32F334R8T6Board_FilterAndOutputs (R41.2)
PB1: [1]STM32F334R8T6Board_MCU (P2.27 Pb.27), [3]STM32F334R8T6Board_FilterAndOutputs (R47.2)
PB2: [1]STM32F334R8T6Board_MCU (P2.28 Pb.28), [3]STM32F334R8T6Board_FilterAndOutputs (R53.2)
PB11: [1]STM32F334R8T6Board_MCU (5 pins), [3]STM32F334R8T6Board_FilterAndOutputs (R56.2)
PB12: [1]STM32F334R8T6Board_MCU (P2.33 Pc.33), [3]STM32F334R8T6Board_FilterAndOutputs (R68.2)
PB13: [1]STM32F334R8T6Board_MCU (P2.34 Pc.34), [3]STM32F334R8T6Board_FilterAndOutputs (R74.2)
PB14: [1]STM32F334R8T6Board_MCU (P2.35 Pc.35), [3]STM32F334R8T6Board_FilterAndOutputs (R62.2)
PB15: [1]STM32F334R8T6Board_MCU (P2.36 Pc.36), [3]STM32F334R8T6Board_FilterAndOutputs (R83.2)
PC0: [1]STM32F334R8T6Board_MCU (P2.8 Pa.8), [2]STM32F334R8T6Board_Interfaces (LCD.11)
PC1: [1]STM32F334R8T6Board_MCU (P2.9 Pa.9), [2]STM32F334R8T6Board_Interfaces (LCD.12)
PC2: [1]STM32F334R8T6Board_MCU (P2.10 Pa.10), [2]STM32F334R8T6Board_Interfaces (LCD.13)
PC3: [1]STM32F334R8T6Board_MCU (P2.11 Pa.11), [2]STM32F334R8T6Board_Interfaces (LCD.14)
PC4: [1]STM32F334R8T6Board_MCU (P2.24 Pb.24), [3]STM32F334R8T6Board_FilterAndOutputs (R29.2)
PC5: [1]STM32F334R8T6Board_MCU (P2.25 Pb.25), [3]STM32F334R8T6Board_FilterAndOutputs (R35.2)
PC6: [1]STM32F334R8T6Board_MCU (P2.37 Pc.37), [3]STM32F334R8T6Board_FilterAndOutputs (R89.2)
PC7: [1]STM32F334R8T6Board_MCU (P2.38 Pc.38), [3]STM32F334R8T6Board_FilterAndOutputs (R71.2)
PC8: [1]STM32F334R8T6Board_MCU (P2.39 Pc.39), [3]STM32F334R8T6Board_FilterAndOutputs (R77.2)
PC9: [1]STM32F334R8T6Board_MCU (P2.40 Pc.40), [3]STM32F334R8T6Board_FilterAndOutputs (R80.2)
PC10: [1]STM32F334R8T6Board_MCU (P2.51 Pd.51), [3]STM32F334R8T6Board_FilterAndOutputs (P5.1)
PC11: [1]STM32F334R8T6Board_MCU (P2.52 Pd.52), [3]STM32F334R8T6Board_FilterAndOutputs (P5.2)
PC12: [1]STM32F334R8T6Board_MCU (P2.53 Pd.53), [3]STM32F334R8T6Board_FilterAndOutputs (P5.3)
PD2: [1]STM32F334R8T6Board_MCU (P2.54 Pd.54), [3]STM32F334R8T6Board_FilterAndOutputs (P5.4)
SD_DI: [1]STM32F334R8T6Board_MCU (CN2.3 P2.57 Pd.57), [3]STM32F334R8T6Board_FilterAndOutputs (H18.1)
SD_DO: [1]STM32F334R8T6Board_MCU (CN2.7 P2.56 Pd.56), [3]STM32F334R8T6Board_FilterAndOutputs (H17.2)
SPI1_CS: [1]STM32F334R8T6Board_MCU (CN2.2 P2.4 Pa.4 R8.2), [3]STM32F334R8T6Board_FilterAndOutputs (H20.2)
SWO: [1]STM32F334R8T6Board_MCU (P2.55 P3.3 Pd.55), [3]STM32F334R8T6Board_FilterAndOutputs (H17.1)